# EAGLE schematic schematic (EAGLE 9.6.0)
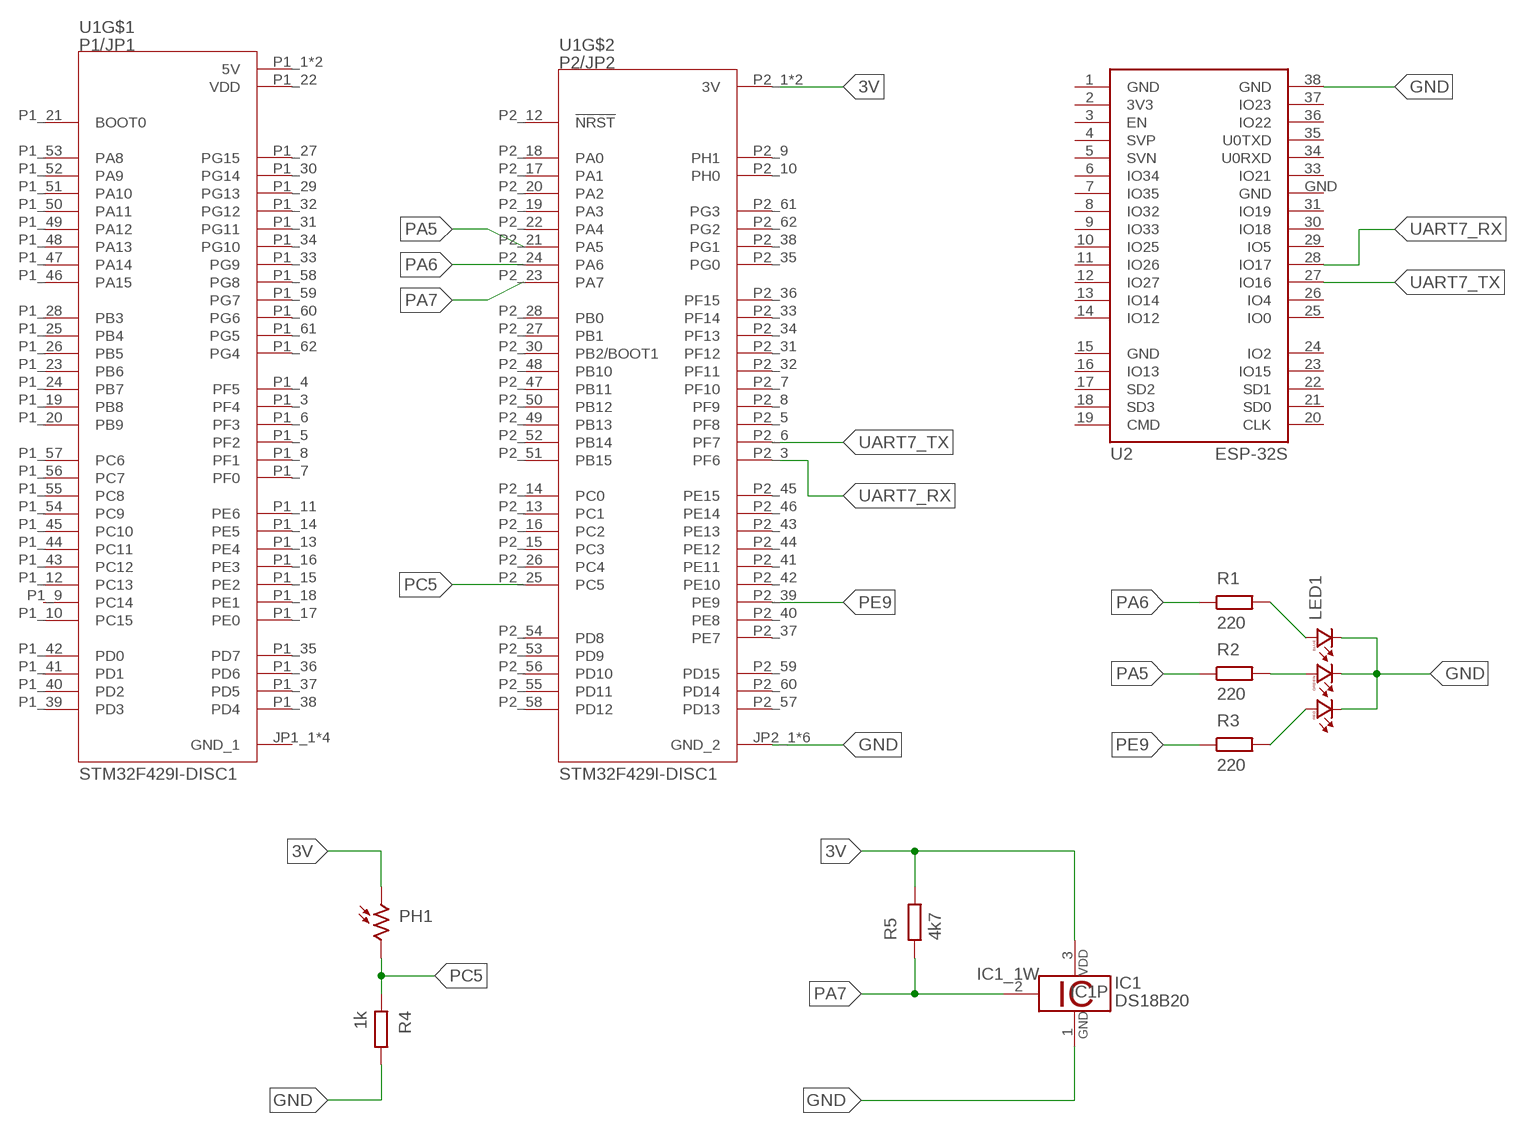
[diagram p0: schematic, sheet 1]

## Parts
IC1  DS18B20  [TO92-]
LED1  F50360  [F50360]
PH1  D1160_12  [D11XX]
R1  220  R  (no package)
R2  220  R  (no package)
R3  220  R  (no package)
R4  1k  R  (no package)
R5  4k7  R  (no package)
U1  STM32F429I-DISC1  [MODULE_STM32F429I-DISC1]
U2  ESP-32S  [ESP-32S]

## Nets
3V: U1.P2_1(3V) U1.P2_2(3V)
GND: LED1.BC LED1.GC LED1.RC U1.JP2_1(GND_2) U1.JP2_2(GND_2) U1.P2_11(GND_2) U1.P2_29(GND_2) U1.P2_63(GND_2) U1.P2_64(GND_2)
N$1: PH1.1
N$2: LED1.BA R1.2
N$3: LED1.GA R2.2
N$4: LED1.RA R3.2
N$5: PH1.2 R4.1
N$6: R4.2
N$7: IC1.3 R5.2
N$8: IC1.2 R5.1
N$9: IC1.1
N$10: R1.1
N$11: R2.1
N$12: R3.1
N$13: U2.27(IO16)
N$14: U2.28(IO17)
N$15: U2.38(GND)
PA5: U1.P2_21(PA5)
PA6: U1.P2_24(PA6)
PA7: U1.P2_23(PA7)
PC5: U1.P2_25(PC5)
PE9: U1.P2_39(PE9)
UART7_RX: U1.P2_3(PF6)
UART7_TX: U1.P2_6(PF7)
Unconnected: U1.P1_3(PF4) U1.P1_4(PF5) U1.P1_5(PF2) U1.P1_6(PF3) U1.P1_7(PF0) U1.P1_8(PF1) U1.P1_9(PC14) U1.P1_10(PC15) U1.P1_11(PE6) U1.P1_12(PC13) U1.P1_13(PE4) U1.P1_14(PE5) U1.P1_15(PE2) U1.P1_16(PE3) U1.P1_17(PE0) U1.P1_18(PE1) U1.P1_19(PB8) U1.P1_20(PB9) U1.P1_21(BOOT0) U1.P1_23(PB6) U1.P1_24(PB7) U1.P1_25(PB4) U1.P1_26(PB5) U1.P1_27(PG15) U1.P1_28(PB3) U1.P1_29(PG13) U1.P1_30(PG14) U1.P1_31(PG11) U1.P1_32(PG12) U1.P1_33(PG9) U1.P1_34(PG10) U1.P1_35(PD7) U1.P1_36(PD6) U1.P1_37(PD5) U1.P1_38(PD4) U1.P1_39(PD3) U1.P1_40(PD2) U1.P1_41(PD1) U1.P1_42(PD0) U1.P1_43(PC12) U1.P1_44(PC11) U1.P1_45(PC10) U1.P1_46(PA15) U1.P1_47(PA14) U1.P1_48(PA13) U1.P1_49(PA12) U1.P1_50(PA11) U1.P1_51(PA10) U1.P1_52(PA9) U1.P1_53(PA8) U1.P1_54(PC9) U1.P1_55(PC8) U1.P1_56(PC7) U1.P1_57(PC6) U1.P1_58(PG8) U1.P1_59(PG7) U1.P1_60(PG6) U1.P1_61(PG5) U1.P1_62(PG4) U1.P2_5(PF8) U1.P2_7(PF10) U1.P2_8(PF9) U1.P2_9(PH1) U1.P2_10(PH0) U1.P2_12(!NRST) U1.P2_13(PC1) U1.P2_14(PC0) U1.P2_15(PC3) U1.P2_16(PC2) U1.P2_17(PA1) U1.P2_18(PA0) U1.P2_19(PA3) U1.P2_20(PA2) U1.P2_22(PA4) U1.P2_26(PC4) U1.P2_27(PB1) U1.P2_28(PB0) U1.P2_30(PB2/BOOT1) U1.P2_31(PF12) U1.P2_32(PF11) U1.P2_33(PF14) U1.P2_34(PF13) U1.P2_35(PG0) U1.P2_36(PF15) U1.P2_37(PE7) U1.P2_38(PG1) U1.P2_40(PE8) U1.P2_41(PE11) U1.P2_42(PE10) U1.P2_43(PE13) U1.P2_44(PE12) U1.P2_45(PE15) U1.P2_46(PE14) U1.P2_47(PB11) U1.P2_48(PB10) U1.P2_49(PB13) U1.P2_50(PB12) U1.P2_51(PB15) U1.P2_52(PB14) U1.P2_53(PD9) U1.P2_54(PD8) U1.P2_55(PD11) U1.P2_56(PD10) U1.P2_57(PD13) U1.P2_58(PD12) U1.P2_59(PD15) U1.P2_60(PD14) U1.P2_61(PG3) U1.P2_62(PG2) U2.3(EN) U2.4(SVP) U2.5(SVN) U2.6(IO34) U2.7(IO35) U2.8(IO32) U2.9(IO33) U2.10(IO25) U2.11(IO26) U2.12(IO27) U2.13(IO14) U2.14(IO12) U2.16(IO13) U2.17(SD2) U2.18(SD3) U2.19(CMD) U2.20(CLK) U2.21(SD0) U2.22(SD1) U2.23(IO15) U2.24(IO2) U2.25(IO0) U2.26(IO4) U2.29(IO5) U2.30(IO18) U2.31(IO19) U2.33(IO21) U2.34(U0RXD) U2.35(U0TXD) U2.36(IO22) U2.37(IO23)

## Power pins joined to a net without a drawn wire
3V3: U2.2(3V3)
5V: U1.P1_1(5V) U1.P1_2(5V)
GND: U2.1(GND) U2.15(GND) U2.GND
GND_1: U1.JP1_1(GND_1) U1.JP1_2(GND_1) U1.P1_63(GND_1) U1.P1_64(GND_1)
VDD: U1.P1_22(VDD)

## Library data of the parts
IC1 = 1wire:DS18B20: Programmable Resolution Digital Thermometer This chip provides a onewire thermosensor with approx. 0.5°C accuracy. A programmable over/undertemperure alarm is available. The precision can be set from 9..12 bits. Notes: Vdd must be applied for accurate measurements at low temperatures, as the parasite power circuit otherwise heats the sensor. If parasite power is used, Vdd has to be connected to GND. The DS1822 is a low-cost thermometer chip, the DS18S20 is similar to the DS18B20, but with 9 Bit precision only. Author: Jan Kandziora <jjj@gmx.de>
LED1 = led:F50360: Full color Z-Power LED RGB P5-II Series Source: http://www.seoulsemicon.co.kr .. F50360.pdf
PH1 = photo-elements:D11: Photo Sensor Oil Burner Control Applications Source: http://optoelectronics.perkinelmer.com/content/Datasheets/DTS_PhotocellsD1160.pdf
R1-R5 = ngspice-simulation:R: RESISTOR
U1 = STM32F429I-DISC1:STM32F429I-DISC1: Application Development Board for the STM32F429 32-Bit Microcontroller; AVAILABILITY: Unavailable; DESCRIPTION: STM32F429 Discovery STM32F4 ARM® Cortex®-M4 MCU 32-Bit Embedded Evaluation Board; MF: STMicroelectronics; MP: STM32F429I-DISC1; PACKAGE: SOIC-14 STMicroelectronics; PRICE: None
U2 = esp32:ESP-32S: Ai-Thinker ESP-32S